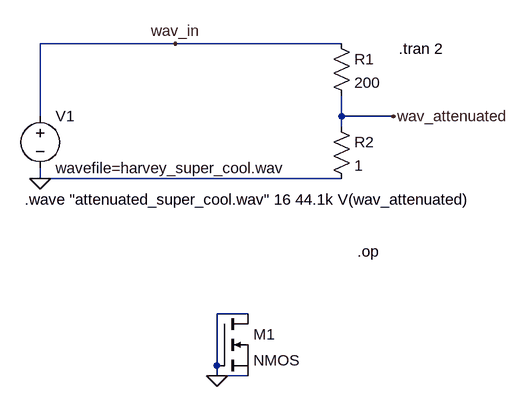
[diagram p0: schematic part_1_c-e.asc]
part_1_c-e.asc, the LTspice schematic file:
Version 4
SHEET 1 944 680
WIRE 400 -48 192 -48
WIRE 656 -48 400 -48
WIRE 192 64 192 -48
WIRE 656 64 656 32
WIRE 736 64 656 64
WIRE 656 80 656 64
WIRE 192 160 192 144
WIRE 656 160 192 160
WIRE 512 368 464 368
WIRE 464 448 464 368
WIRE 464 464 464 448
WIRE 512 464 464 464
FLAG 400 -48 wav_in
FLAG 736 64 wav_attenuated
FLAG 192 160 0
FLAG 464 464 0
SYMBOL voltage 192 48 R0
SYMATTR InstName V1
SYMATTR Value wavefile=harvey_super_cool.wav
SYMBOL res 640 -64 R0
SYMATTR InstName R1
SYMATTR Value 200
SYMBOL res 640 64 R0
SYMATTR InstName R2
SYMATTR Value 1
SYMBOL nmos 464 368 R0
SYMATTR InstName M1
SYMATTR SpiceLine w=18000u L=10u
TEXT 168 192 Left 2 !.wave "attenuated_super_cool.wav" 16 44.1k V(wav_attenuated)
TEXT 744 -40 Left 2 !.tran 2
TEXT 680 272 Left 2 !.op

The netlist it stands for:
* part_1_c-e.asc
V1 wav_in 0 wavefile=harvey_super_cool.wav
R1 wav_in wav_attenuated 200
R2 wav_attenuated 0 1
M1 0 0 0 0 NMOS w=18000u L=10u
.model NMOS NMOS
.model PMOS PMOS
.lib standard.mos
.wave "attenuated_super_cool.wav" 16 44.1k V(wav_attenuated)
.tran 2
.op
.backanno
.end